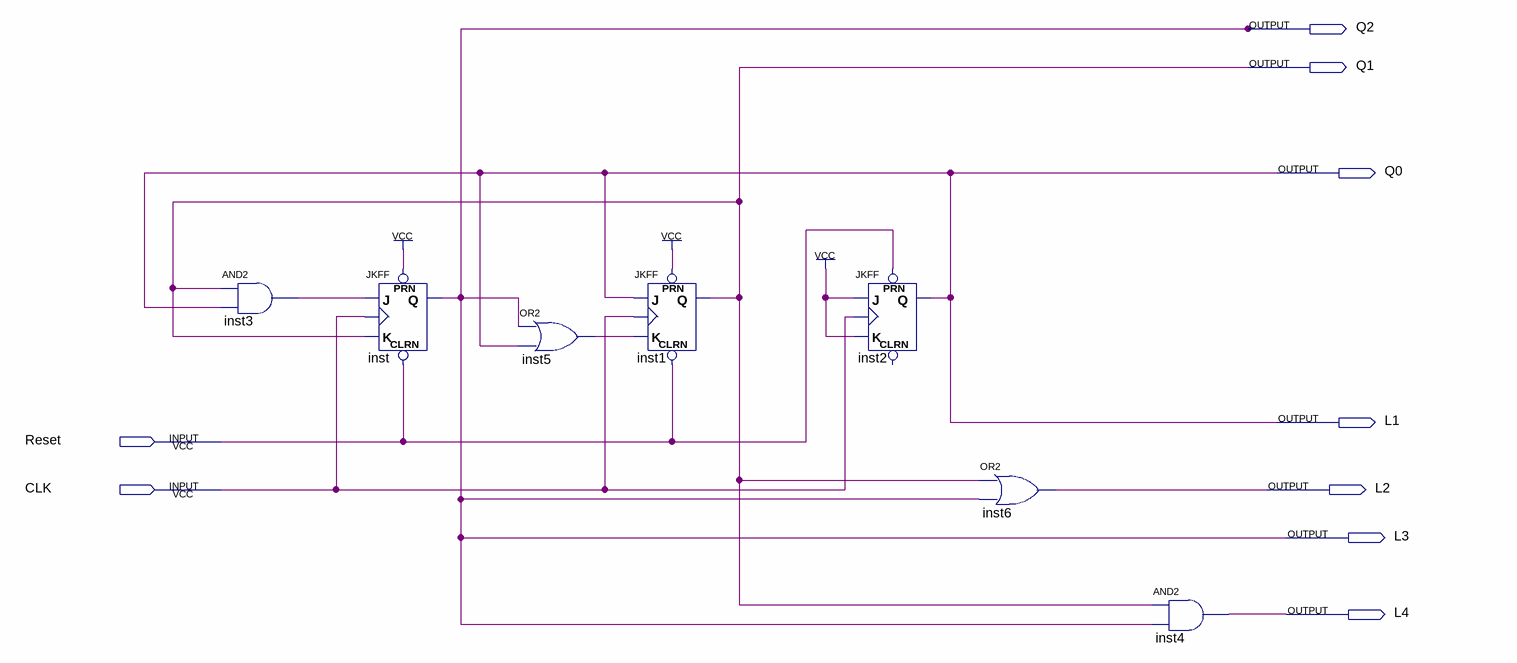
[diagram p0: schematic sheet]
// Quartus schematic ex1_2_JK.bdf as structural Verilog: 7 symbols, 9 pins
module ex1_2_JK (
  input  Reset,
  input  CLK,
  output Q2,
  output Q1,
  output Q0,
  output L1,
  output L2,
  output L3,
  output L4
);

  wire inst3_out, inst5_out;

  and inst3 (inst3_out, Q1, L1);
  JKFF inst (.PRN(1'b1), .CLRN(Reset), .K(Q1), .J(inst3_out), .CLK(CLK), .Q(L3));
  or inst5 (inst5_out, L3, L1);
  JKFF inst1 (.PRN(1'b1), .CLRN(Reset), .K(inst5_out), .J(L1), .CLK(CLK), .Q(Q1));
  JKFF inst2 (.PRN(Reset), .K(1'b1), .J(1'b1), .CLK(CLK), .Q(L1));  // open: CLRN
  or inst6 (L2, Q1, L3);
  and inst4 (L4, Q1, L3);

  assign Q0 = L1;
  assign Q2 = L3;
endmodule
